# EAGLE schematic THC-schematicRevE (EAGLE 6.4)
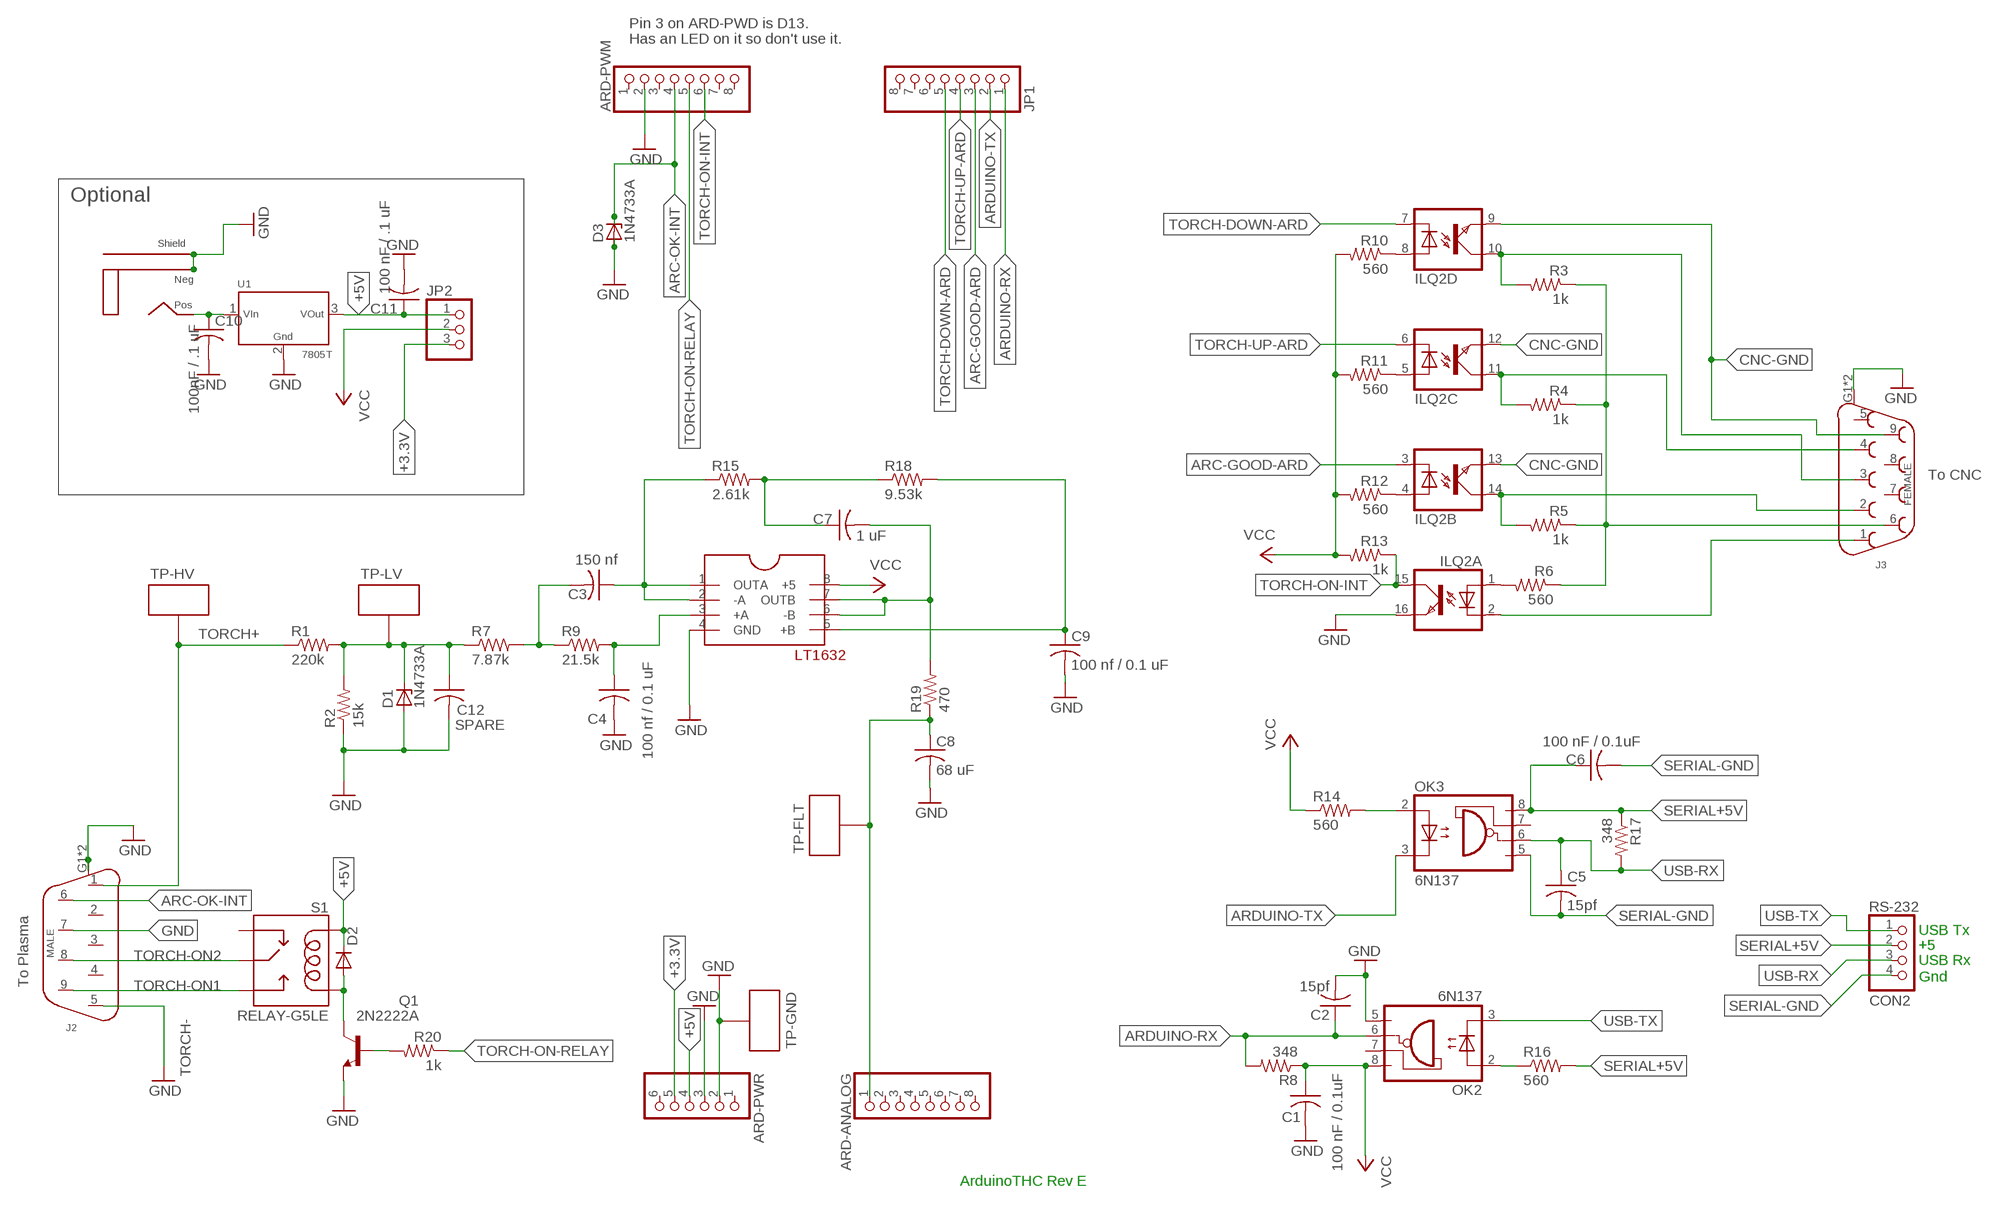
[diagram p0: schematic, sheet 1]

## Parts
ARD-ANALOG  PINHD-1X8  [1X08]
ARD-PWM  PINHD-1X8  [1X08]
ARD-PWR  PINHD-1X6  [1X06]
C1  100 nF / 0.1uF  C-US025-025X050  [C025-025X050]
C2  15pf  C-US025-025X050  [C025-025X050]
C3  150 nf  C-US025-025X050  [C025-025X050]
C4  100 nf / 0.1 uF  C-US025-025X050  [C025-025X050]
C5  15pf  C-US025-025X050  [C025-025X050]
C6  100 nF / 0.1uF  C-US025-025X050  [C025-025X050]
C7  1 uF  C-US025-025X050  [C025-025X050]
C8  68 uF  C-US025-025X050  [C025-025X050]
C9  100 nf / 0.1 uF  C-US025-025X050  [C025-025X050]
C10  100nF / .1 uF  C-US025-025X050  [C025-025X050]
C11  100 nF / .1 uF  C-US025-025X050  [C025-025X050]
C12  SPARE  C-US025-025X050  [C025-025X050]
D1  1N4733A  ZPY  [DO41Z10]
D2  1N4001  [DO-204AL]
D3  1N4733A  ZPY  [DO41Z10]
ILQ2  ILQ1  [DIL16]
J1  2.1MM-PLUG-PCB-MNT  [2.1MM-PLUG]
J2  DB9-MALE  [DB9M-RIGHT-ANGLE]
J3  DB9-FEMALE  [DB9F-RIGHT-ANGLE]
JP1  PINHD-1X8  [1X08]
JP2  PINHD-1X3  [1X03]
OK2  6N137  [DIL08]
OK3  6N137  [DIL08]
Q1  2N2222A  [TO18]
R1  220k  R-US_0207/7  [0207/7]
R2  15k  R-US_0207/7  [0207/7]
R3  1k  R-US_0207/7  [0207/7]
R4  1k  R-US_0207/7  [0207/7]
R5  1k  R-US_0207/7  [0207/7]
R6  560  R-US_0207/7  [0207/7]
R7  7.87k  R-US_0207/7  [0207/7]
R8  348  R-US_0207/7  [0207/7]
R9  21.5k  R-US_0207/7  [0207/7]
R10  560  R-US_0207/7  [0207/7]
R11  560  R-US_0207/7  [0207/7]
R12  560  R-US_0207/7  [0207/7]
R13  1k  R-US_0207/7  [0207/7]
R14  560  R-US_0207/7  [0207/7]
R15  2.61k  R-US_0207/7  [0207/7]
R16  560  R-US_0207/7  [0207/7]
R17  348  R-US_0207/7  [0207/7]
R18  9.53k  R-US_0207/7  [0207/7]
R19  470  R-US_0207/7  [0207/7]
R20  1k  R-US_0207/7  [0207/7]
RS-232  CON2  PINHD-1X4  [1X04]
S1  RELAY-G5LE  [RELAY-G5LE]
TP-FLT  TEST-POINT-.040-HOLE  [TP.040]
TP-GND  TEST-POINT-.040-HOLE  [TP.040]
TP-HV  TEST-POINT-.040-HOLE  [TP.040]
TP-LV  TEST-POINT-.040-HOLE  [TP.040]
U1  7805T  [TO-220-3]
U$1  LT1632  [DIP08]

## Nets
+3.3V: ARD-PWR.5 JP2.3
+5V: ARD-PWR.4 C11.1 D2.C JP2.1 S1.P$5-COIL(COIL-2) U1.3(VOUT)
ARC-GOOD-ARD: ILQ2.3(B:C) JP1.3
ARC-OK-INT: ARD-PWM.4 D3.C J2.6
ARD-ANALOG-IN: ARD-ANALOG.1 C8.1 R19.1 TP-FLT.P$1
ARDUINO-RX: C2.1 JP1.1 OK2.6(VO) R8.2
ARDUINO-TX: JP1.2 OK3.3(C)
CNC+5: J3.6 R3.1 R4.1 R5.1 R6.1
CNC-ARC-GOOD: ILQ2.14(B:COL) J3.2 R5.2
CNC-GND: ILQ2.9(D:EMIT) ILQ2.12(C:EMIT) ILQ2.13(B:EMIT) J3.9
CNC-TORCH-DOWN: ILQ2.10(D:COL) J3.3 R3.2
CNC-TORCH-ON: ILQ2.2(A:C) J3.1
CNC-TORCH-UP: ILQ2.11(C:COL) J3.4 R4.2
DIVIDER: C12.1 D1.C R1.2 R2.2 R7.1 TP-LV.P$1
GND: ARD-PWM.2 ARD-PWR.2 ARD-PWR.3 C1.2 C2.2 C4.2 C8.2 C9.2 C10.2 C11.2 C12.2 D1.A D3.A ILQ2.16(A:EMIT) J1.P$NEG J1.P$SHLD J2.5 J2.7 J2.G1(P$SHLD) J2.G2(P$SHLD) J3.G1(P$SHLD) J3.G2(P$SHLD) OK2.5(GND) Q1.1(E) R2.1 TP-GND.P$1 U1.2(GND) U$1.4(GND)
N$1: C10.1 J1.P$POS U1.1(VIN)
N$2: ILQ2.4(B:A) R12.1
N$3: D2.A Q1.3(C) S1.P$2-COIL(COIL-1)
N$4: Q1.2(B) R20.2
N$7: ILQ2.5(C:A) R11.1
N$8: ILQ2.8(D:A) R10.1
N$9: ILQ2.1(A:A) R6.2
N$26: C3.2 R7.2 R9.1
N$27: C4.1 R9.2 U$1.3(+A)
N$29: C3.1 R15.1 U$1.1(OUTA) U$1.2(-A)
N$30: C7.1 R15.2 R18.1
N$31: C9.1 R18.2 U$1.5(+B)
N$32: OK3.2(A) R14.2
N$34: OK2.2(A) R16.1
SERIAL+5V: C6.1 OK3.8(VCC) R16.2 R17.1 RS-232.2
SERIAL-GND: C5.2 C6.2 OK3.5(GND) RS-232.4
TORCH+: J2.1 R1.1 TP-HV.P$1
TORCH-DOWN-ARD: ILQ2.7(D:C) JP1.5
TORCH-ON1: J2.9 S1.P$4-NO(NO)
TORCH-ON2: J2.8 S1.P$1-COMMON(COM)
TORCH-ON-INT: ARD-PWM.6 ILQ2.15(A:COL) R13.1
TORCH-ON-RELAY: ARD-PWM.5 R20.1
TORCH-UP-ARD: ILQ2.6(C:C) JP1.4
UNFILTERED: C7.2 R19.2 U$1.6(-B) U$1.7(OUTB)
USB-RX: C5.1 OK3.6(VO) R17.2 RS-232.3
USB-TX: OK2.3(C) RS-232.1
VCC: C1.1 JP2.2 OK2.8(VCC) R8.1 R10.2 R11.2 R12.2 R13.2 R14.1 U$1.8(+5)
Unconnected: ARD-ANALOG.2 ARD-ANALOG.3 ARD-ANALOG.4 ARD-ANALOG.5 ARD-ANALOG.6 ARD-ANALOG.7 ARD-ANALOG.8 ARD-PWM.1 ARD-PWM.3 ARD-PWM.7 ARD-PWM.8 ARD-PWR.1 ARD-PWR.6 J2.2 J2.3 J2.4 J3.5 J3.7 J3.8 JP1.6 JP1.7 JP1.8 OK2.7(VE) OK3.7(VE) S1.P$3-NC(NC)

## Notes on the sheet
- Pin 3 on ARD-PWD is D13.
  Has an LED on it so don't use it.
- Optional
- To CNC
- TORCH+
- To Plasma
- USB Tx
- +5
- USB Rx
- Gnd
- TORCH-
- ArduinoTHC Rev E

## Library data of the parts
ARD-ANALOG ARD-PWM JP1 = pinhead:PINHD-1X8: PIN HEADER
ARD-PWR = pinhead:PINHD-1X6: PIN HEADER
C1-C12 = resistor:C-US: CAPACITOR, American symbol
D1 D3 = diode:ZPY: Z DIODE 1 W
D2 = DIODE-1N4001:1N4001
ILQ2 = optocoupler:ILQ1: SIEMENS OPTO COUPLER; MF: VISHAY/TELEFUNKEN; MPN: ILQ1; OC_FARNELL: 1469501; OC_NEWARK: 88K1954
J1 = ArdunioPowerJack:2.1MM-PLUG-PCB-MNT
J2 = DB-9Male-Rangle-RMG:DB9-MALE
J3 = DB-9Male-Rangle-RMG:DB9-FEMALE
JP2 = pinhead:PINHD-1X3: PIN HEADER
OK2 OK3 = optocoupler:6N137: MOTOROLA OPTO COUPLER; MPN: 6N137; OC_FARNELL: 1328376; OC_NEWARK: 52M1895
Q1 = transistor-npn:2N2222*: NPN Transistor
R1-R20 = resistor:R-US_: RESISTOR, American symbol
RS-232 = pinhead:PINHD-1X4: PIN HEADER
S1 = RELAY-G5LE:RELAY-G5LE
TP-FLT TP-GND TP-HV TP-LV = TestPoint:TEST-POINT-.040-HOLE
U1 = 7805Regulator-RMG:7805T
U$1 = ArduinoThcOpAmp:LT1632